# Altium schematic sheet MB1134.SchDoc
size A4; DocumentNumber: 1; Revision: A.1(PCB.SCH); SheetNumber: 1; SheetTotal: 3; PageSetup: Record=PageOptions|CenterHorizontal=True|CenterVertical=True|PrintScale=1.00|XCorrection=1.00|YCorrection=1.00|PrintKind=1|BorderSize=5000000|LeftOffset=0|BottomOffset=0|Orientation=2|PaperLength=1000|PaperWidth=1000|Scale=100|PaperSource=15|PrintQuality=1200|MediaType=1|DitherType=10|PaperKind=A4|PrintScaleMode=1
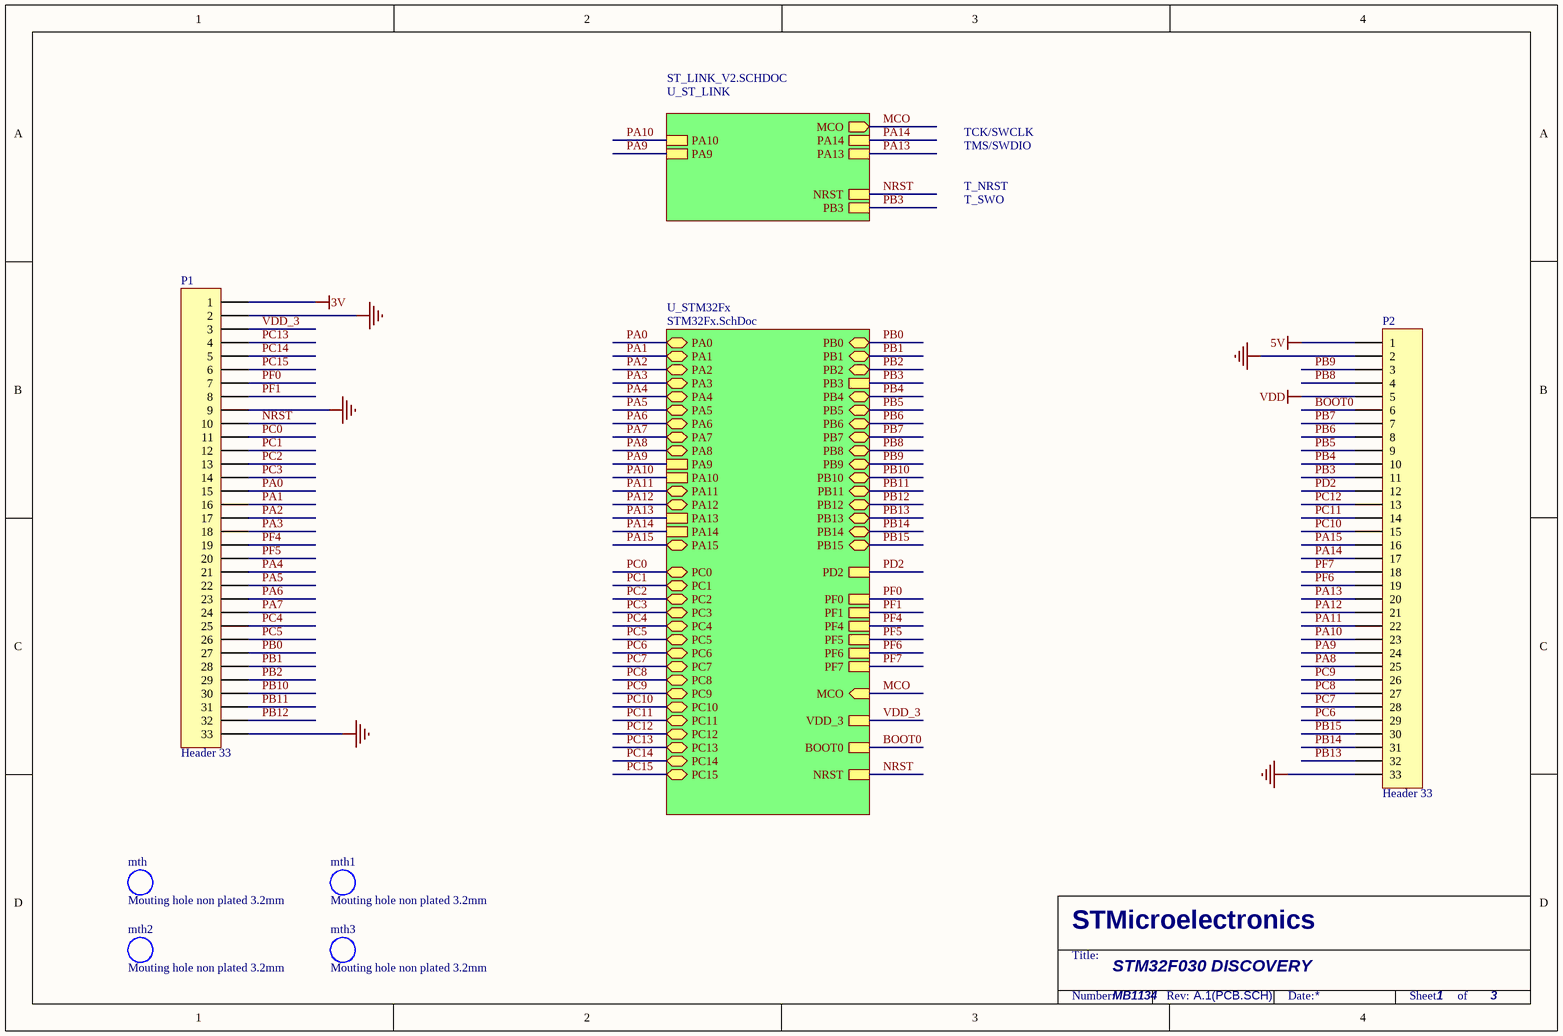
[diagram p0: MB1134.SchDoc]

## Parts
mth  Mouting hole non plated 3.2mm  [mounting]
mth1  Mouting hole non plated 3.2mm  [mounting]
mth2  Mouting hole non plated 3.2mm  [mounting]
mth3  Mouting hole non plated 3.2mm  [mounting]
P1  Header 33  [SAMTEC_MTSW-133-22-S-S-400]
P2  Header 33  [SAMTEC_MTSW-133-22-S-S-400]

## Sub-sheets
U_ST_LINK = ST_LINK_V2.SCHDOC: PA13, PA14, NRST, PB3, MCO (out), PA10, PA9
U_STM32Fx = STM32Fx.SchDoc: PA13, PA14, PA15 (bidir), PA12 (bidir), PA0 (bidir), PA1 (bidir), PA2 (bidir), PA3 (bidir), PA4 (bidir), PA5 (bidir), PA6 (bidir), PA7 (bidir), PA8 (bidir), PA9, PA10, PA11 (bidir), PB12 (bidir), PB0 (bidir), PB1 (bidir), PB2 (bidir), PB3, PB4 (bidir), PB5 (bidir), PB6 (bidir), PB7 (bidir), PB8 (bidir), PB9 (bidir), PB10 (bidir), PB11 (bidir), PB13 (bidir), PB14 (bidir), PB15 (bidir), PC3 (bidir), PC15 (bidir), PC14 (bidir), PC13 (bidir), PC12 (bidir), PC11 (bidir), PC10 (bidir), PC9 (bidir), PC8 (bidir), PC7 (bidir), PC6 (bidir), PC5 (bidir), PC4 (bidir), PC2 (bidir), PC1 (bidir), PC0 (bidir), PD2, BOOT0, NRST, MCO (in), VDD_3, PF7, PF6, PF5, PF4, PF1, PF0

## Nets
3V: P1.1
5V: P2.1
GND: P1.2 P1.9 P1.33 P2.2 P2.33
VDD: P2.5
BOOT0: P2.6 ; sheet U_STM32Fx/BOOT0
MCO: sheet U_ST_LINK/MCO, sheet U_STM32Fx/MCO
NRST: P1.10 ; sheet U_ST_LINK/NRST, sheet U_STM32Fx/NRST
PA0: P1.15 ; sheet U_STM32Fx/PA0
PA1: P1.16 ; sheet U_STM32Fx/PA1
PA2: P1.17 ; sheet U_STM32Fx/PA2
PA3: P1.18 ; sheet U_STM32Fx/PA3
PA4: P1.21 ; sheet U_STM32Fx/PA4
PA5: P1.22 ; sheet U_STM32Fx/PA5
PA6: P1.23 ; sheet U_STM32Fx/PA6
PA7: P1.24 ; sheet U_STM32Fx/PA7
PA8: P2.25 ; sheet U_STM32Fx/PA8
PA9: P2.24 ; sheet U_ST_LINK/PA9, sheet U_STM32Fx/PA9
PA10: P2.23 ; sheet U_ST_LINK/PA10, sheet U_STM32Fx/PA10
PA11: P2.22 ; sheet U_STM32Fx/PA11
PA12: P2.21 ; sheet U_STM32Fx/PA12
PA13: P2.20 ; sheet U_ST_LINK/PA13, sheet U_STM32Fx/PA13
PA14: P2.17 ; sheet U_ST_LINK/PA14, sheet U_STM32Fx/PA14
PA15: P2.16 ; sheet U_STM32Fx/PA15
PB0: P1.27 ; sheet U_STM32Fx/PB0
PB1: P1.28 ; sheet U_STM32Fx/PB1
PB2: P1.29 ; sheet U_STM32Fx/PB2
PB3: P2.11 ; sheet U_ST_LINK/PB3, sheet U_STM32Fx/PB3
PB4: P2.10 ; sheet U_STM32Fx/PB4
PB5: P2.9 ; sheet U_STM32Fx/PB5
PB6: P2.8 ; sheet U_STM32Fx/PB6
PB7: P2.7 ; sheet U_STM32Fx/PB7
PB8: P2.4 ; sheet U_STM32Fx/PB8
PB9: P2.3 ; sheet U_STM32Fx/PB9
PB10: P1.30 ; sheet U_STM32Fx/PB10
PB11: P1.31 ; sheet U_STM32Fx/PB11
PB12: P1.32 ; sheet U_STM32Fx/PB12
PB13: P2.32 ; sheet U_STM32Fx/PB13
PB14: P2.31 ; sheet U_STM32Fx/PB14
PB15: P2.30 ; sheet U_STM32Fx/PB15
PC0: P1.11 ; sheet U_STM32Fx/PC0
PC1: P1.12 ; sheet U_STM32Fx/PC1
PC2: P1.13 ; sheet U_STM32Fx/PC2
PC3: P1.14 ; sheet U_STM32Fx/PC3
PC4: P1.25 ; sheet U_STM32Fx/PC4
PC5: P1.26 ; sheet U_STM32Fx/PC5
PC6: P2.29 ; sheet U_STM32Fx/PC6
PC7: P2.28 ; sheet U_STM32Fx/PC7
PC8: P2.27 ; sheet U_STM32Fx/PC8
PC9: P2.26 ; sheet U_STM32Fx/PC9
PC10: P2.15 ; sheet U_STM32Fx/PC10
PC11: P2.14 ; sheet U_STM32Fx/PC11
PC12: P2.13 ; sheet U_STM32Fx/PC12
PC13: P1.4 ; sheet U_STM32Fx/PC13
PC14: P1.5 ; sheet U_STM32Fx/PC14
PC15: P1.6 ; sheet U_STM32Fx/PC15
PD2: P2.12 ; sheet U_STM32Fx/PD2
PF0: P1.7 ; sheet U_STM32Fx/PF0
PF1: P1.8 ; sheet U_STM32Fx/PF1
PF4: P1.19 ; sheet U_STM32Fx/PF4
PF5: P1.20 ; sheet U_STM32Fx/PF5
PF6: P2.19 ; sheet U_STM32Fx/PF6
PF7: P2.18 ; sheet U_STM32Fx/PF7
VDD_3: P1.3 ; sheet U_STM32Fx/VDD_3

## Notes on the sheet
- TCK/SWCLK
- TMS/SWDIO
- T_SWO
- T_NRST
- STM32F030 DISCOVERY
- MB1134
- 1
- STMicroelectronics
- Title:
- Number:
- Rev:
- Date:
- Sheet       of

## Library data of the parts
mth mth1-mth3 = mth
P1 P2 = Header 33: Header, 33-Pin; LatestRevisionDate: 17-Jul-2002; LatestRevisionNote: Re-released for DXP Platform.; Publisher: Altium Limited